# EAGLE design helmholtz_cage_pcb_design (EAGLE 9.5.1)
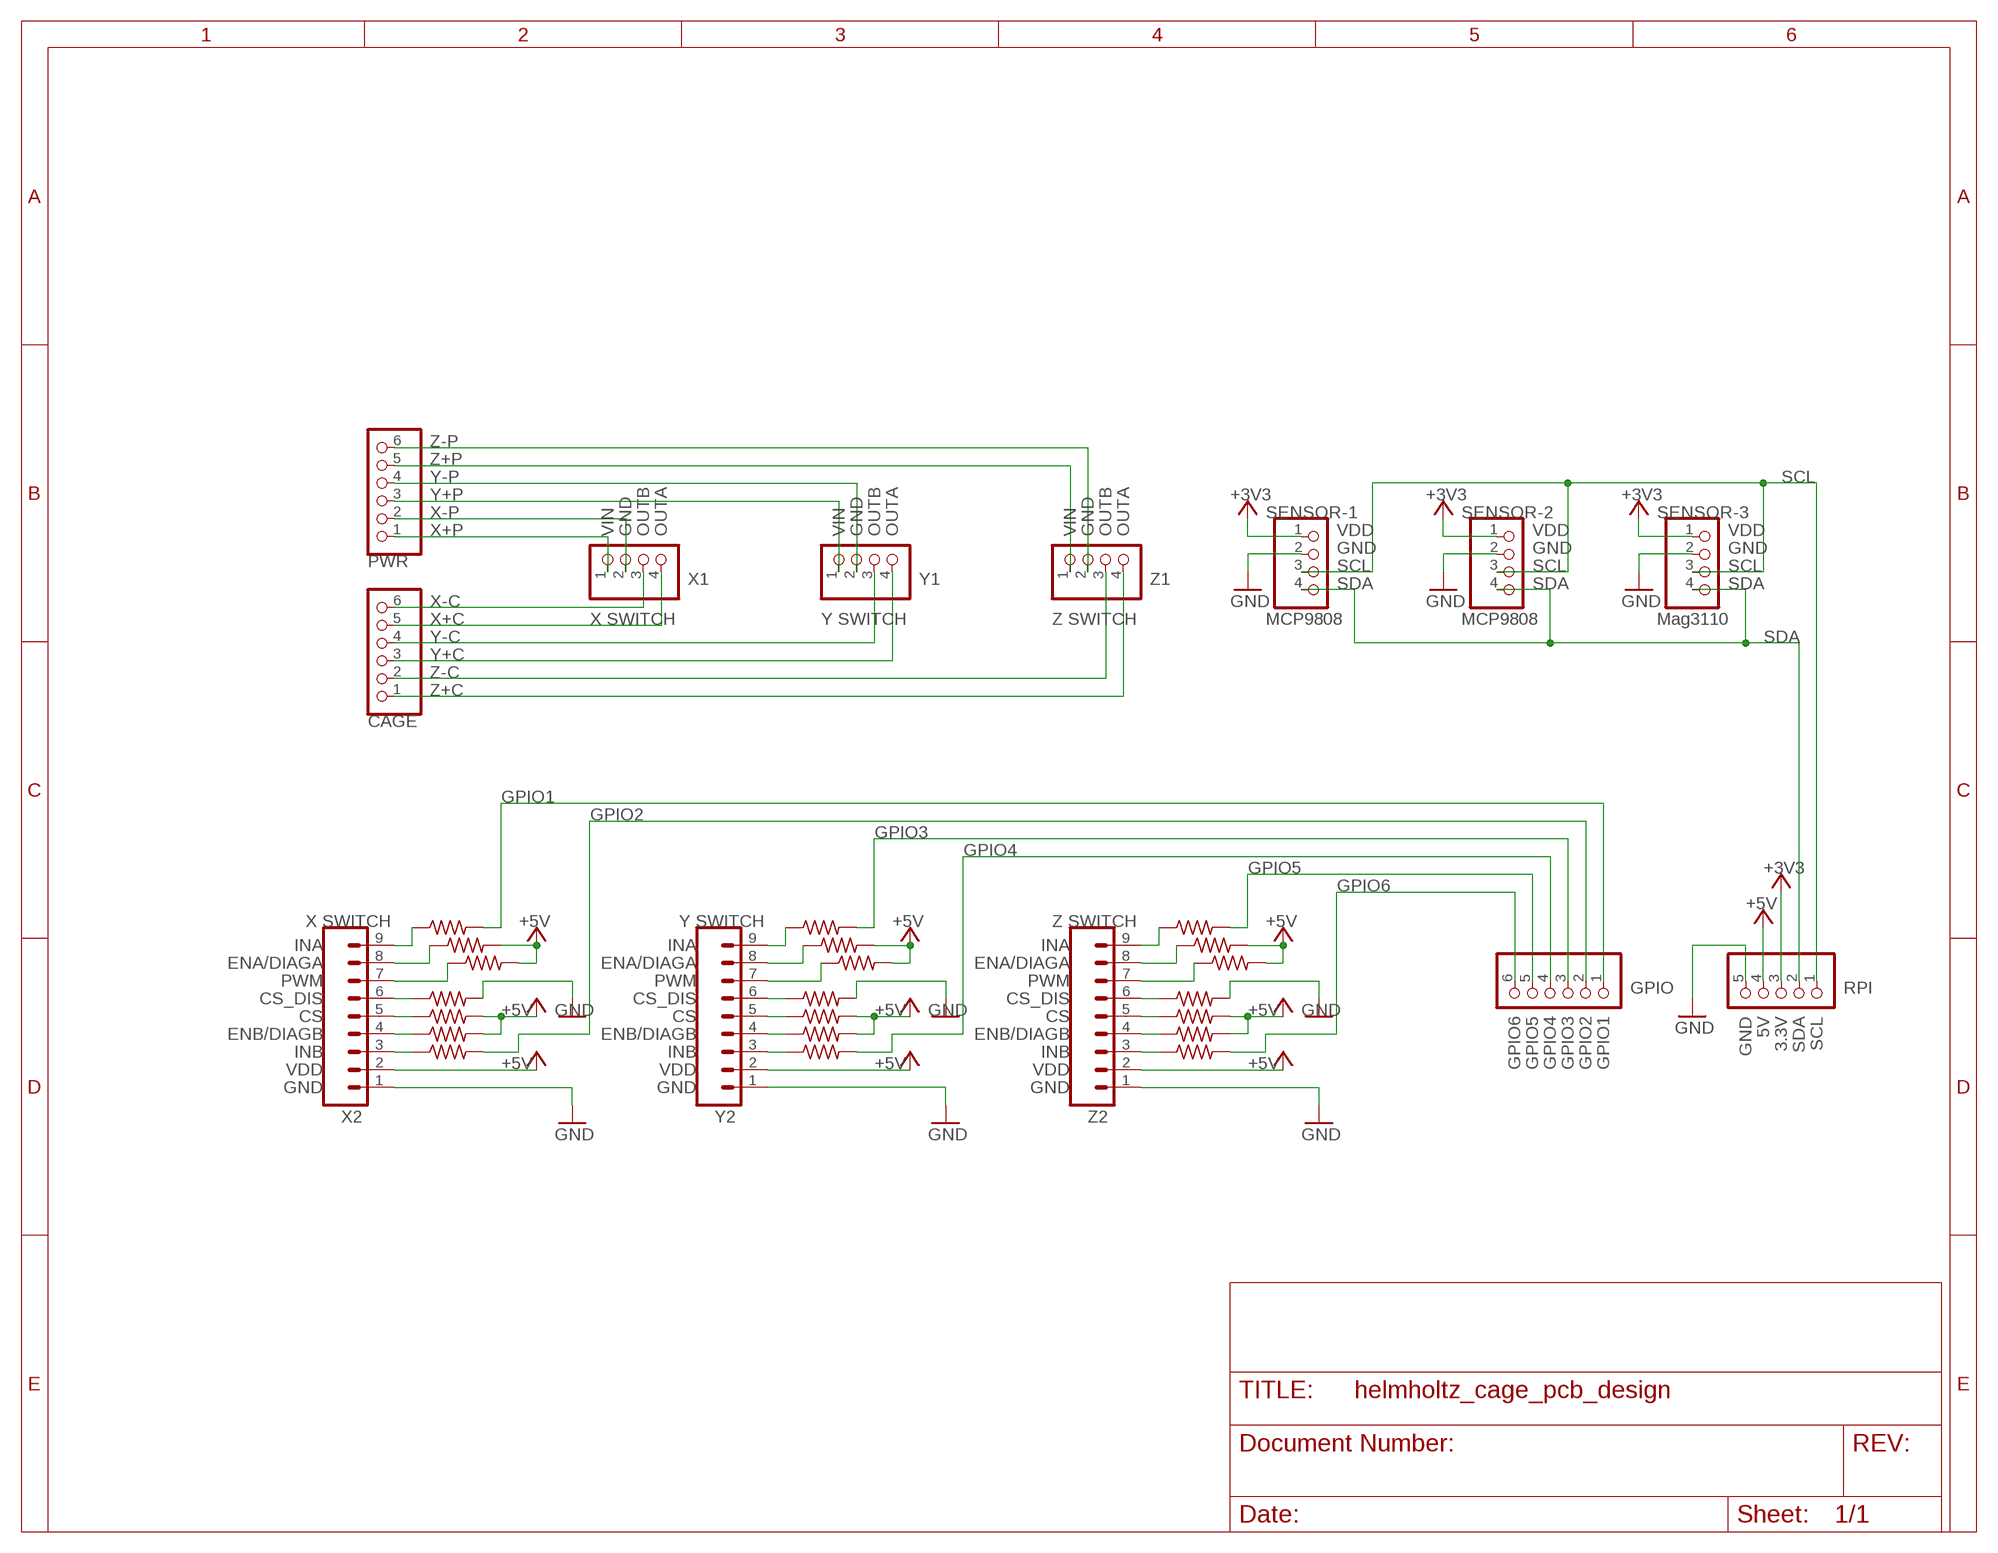
[diagram p0: schematic, sheet 1]

## Parts
CAGE  PINHD-1X6  [1X06]
GPIO  PINHD-1X6  [1X06]
PWR  PINHD-1X6  [1X06]
R1  R-US_0204/7  [0204/7]
R2  R-US_0204/7  [0204/7]
R3  R-US_0204/7  [0204/7]
R4  R-US_0204/7  [0204/7]
R5  R-US_0204/7  [0204/7]
R6  R-US_0204/7  [0204/7]
R7  R-US_0204/7  [0204/7]
R8  R-US_0204/7  [0204/7]
R9  R-US_0204/7  [0204/7]
R10  R-US_0204/7  [0204/7]
R11  R-US_0204/7  [0204/7]
R12  R-US_0204/7  [0204/7]
R13  R-US_0204/7  [0204/7]
R14  R-US_0204/7  [0204/7]
R15  R-US_0204/7  [0204/7]
R16  R-US_0204/7  [0204/7]
R17  R-US_0204/7  [0204/7]
R18  R-US_0204/7  [0204/7]
R19  R-US_0204/7  [0204/7]
R20  R-US_0204/7  [0204/7]
R21  R-US_0204/7  [0204/7]
RPI  PINHD-1X5  [1X05]
SENSOR-1  PINHD-1X4  [1X04]
SENSOR-2  PINHD-1X4  [1X04]
SENSOR-3  PINHD-1X4  [1X04]
X1  PINHD-1X4  [1X04]
X2  CONN_09  [1X09]
Y1  PINHD-1X4  [1X04]
Y2  CONN_09  [1X09]
Z1  PINHD-1X4  [1X04]
Z2  CONN_09  [1X09]

## Nets
+3V3: RPI.3 SENSOR-1.1 SENSOR-2.1 SENSOR-3.1
+5V: R3.2 R4.2 R5.2 R7.2 R8.2 R10.2 R11.2 R12.2 R17.2 R18.2 R19.2 R21.2 RPI.4 X2.2 Y2.2 Z2.2
CSX: R7.1 X2.5
CSY: R8.1 Y2.5
CSZ: R21.1 Z2.5
DISX: R6.1 X2.6
DISY: R9.1 Y2.6
DISZ: R20.1 Z2.6
ENAX: R3.1 X2.8
ENAY: R12.1 Y2.8
ENAZ: R17.1 Z2.8
ENBX: R4.1 X2.4
ENBY: R11.1 Y2.4
ENBZ: R18.1 Z2.4
GND: R6.2 R9.2 R20.2 RPI.5 SENSOR-1.2 SENSOR-2.2 SENSOR-3.2 X2.1 Y2.1 Z2.1
GPIO1: GPIO.1 R1.2
GPIO2: GPIO.2 R2.2
GPIO3: GPIO.3 R14.2
GPIO4: GPIO.4 R13.2
GPIO5: GPIO.5 R15.2
GPIO6: GPIO.6 R16.2
PWMX: R5.1 X2.7
PWMY: R10.1 Y2.7
PWMZ: R19.1 Z2.7
RGP1: R1.1 X2.9
RGP2: R2.1 X2.3
RGP3: R14.1 Y2.9
RGP4: R13.1 Y2.3
RGP5: R15.1 Z2.9
RGP6: R16.1 Z2.3
SCL: RPI.1 SENSOR-1.3 SENSOR-2.3 SENSOR-3.3
SDA: RPI.2 SENSOR-1.4 SENSOR-2.4 SENSOR-3.4
X+C: CAGE.5 X1.4
X+P: PWR.1 X1.1
X-C: CAGE.6 X1.3
X-P: PWR.2 X1.2
Y+C: CAGE.3 Y1.4
Y+P: PWR.3 Y1.1
Y-C: CAGE.4 Y1.3
Y-P: PWR.4 Y1.2
Z+C: CAGE.1 Z1.4
Z+P: PWR.5 Z1.1
Z-C: CAGE.2 Z1.3
Z-P: PWR.6 Z1.2

## Notes on the sheet
- SCL
- VIN | GND | OUTB | OUTA | VIN | GND | OUTB | OUTA | VIN | GND | OUTB | OUTA | VDD | VDD | VDD
- GND | GND | GND
- SCL | SCL | SCL
- SDA | SDA | SDA
- X SWITCH | Y SWITCH | Z SWITCH | MCP9808 | MCP9808 | Mag3110
- SDA
- X SWITCH | Y SWITCH | Z SWITCH
- INA | INA | INA
- ENA/DIAGA | ENA/DIAGA | ENA/DIAGA
- PWM | PWM | PWM
- CS_DIS | CS_DIS | CS_DIS
- CS | CS | CS | GPIO6 | GPIO5 | GPIO4 | GPIO3 | GPIO2 | GPIO1 | GND | 5V | 3.3V | SDA | SCL
- ENB/DIAGB | ENB/DIAGB | ENB/DIAGB
- INB | INB | INB
- VDD | VDD | VDD
- GND | GND | GND

## Library data of the parts
CAGE GPIO PWR = pinhead:PINHD-1X6: PIN HEADER
R1-R21 = rcl:R-US_: RESISTOR, American symbol; SPICEPREFIX: R
RPI = pinhead:PINHD-1X5: PIN HEADER
SENSOR-1-SENSOR-3 X1 Y1 Z1 = pinhead:PINHD-1X4: PIN HEADER
X2 Y2 Z2 = SparkFun-Connectors:CONN_09: Multi connection point. Often used as Generic Header-pin footprint for 0.1 inch spaced/style header connections On any of the 0.1 inch spaced packages, you can populate with these: Break Away Headers - Straight <https://www.sparkfun.com/products/116> (PRT-00116) Break Away Male Headers - Right Angle <https://www.sparkfun.com/products/553> (PRT-00553) Female Headers <https://www.sparkfun.com/products/115> (PRT-00115) Break Away Headers - Machine Pin <https://www.sparkfun.com/products/117> (PRT-00117) Break Away Female Headers - Swiss Machine Pin <https://www.sparkfun.com/products/743> (PRT-00743) For SCREWTERMINALS and SPRING TERMINALS visit here: Screw Terimnals on SparkFun.com <https://www.sparkfun.com/search/results?term=Screw+Terminals> (5mm/3.5mm/2.54mm spacing) This device is also useful as a general connection point to wire up your design to another part of your project. Our various solder wires solder well into these plated through hole pads. Hook-Up Wire - Assortment (Stranded, 22 AWG) <https://www.sparkfun.com/products/11375> (PRT-11375) Hook-Up Wire - Assortment (Solid Core, 22 AWG) <https://www.sparkfun.com/products/11367> (PRT-11367) View the entire wire category on our website here <https://www.sparkfun.com/categories/141> Special notes: Molex polarized connector foot print use with SKU : PRT-08231 with associated crimp pins and housings. 1MM SMD Version SKU: PRT-10208 NOTES ON THE VARIANTS LOCK and LOCK_LONGPADS... This footprint was designed to help hold the alignment of a through-hole component (i.e. 6-pin header) while soldering it into place. You may notice that each hole has been shifted either up or down by 0.005 of an inch from it's more standard position (which is a perfectly straight line). This slight alteration caused the pins (the squares in the middle) to touch the edges of the holes. Because they are alternating, it causes a "brace" to hold the component in place. 0.005 has proven to be the perfect amount of "off-center" position when using our standard breakaway headers. Although looks a little odd when you look at the bare footprint, once you have a header in there, the alteration is very hard to notice. Also,if you push a header all the way into place, it is covered up entirely on the bottom side.

## Board
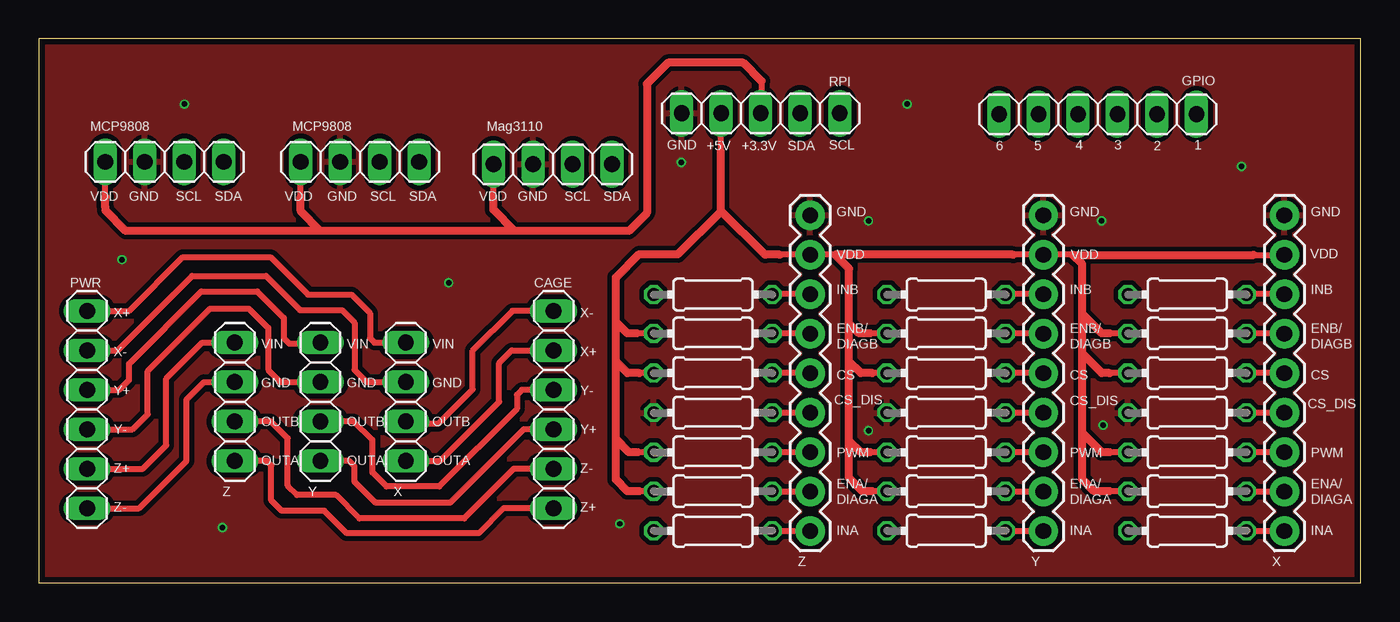
[diagram p1: board, top side]
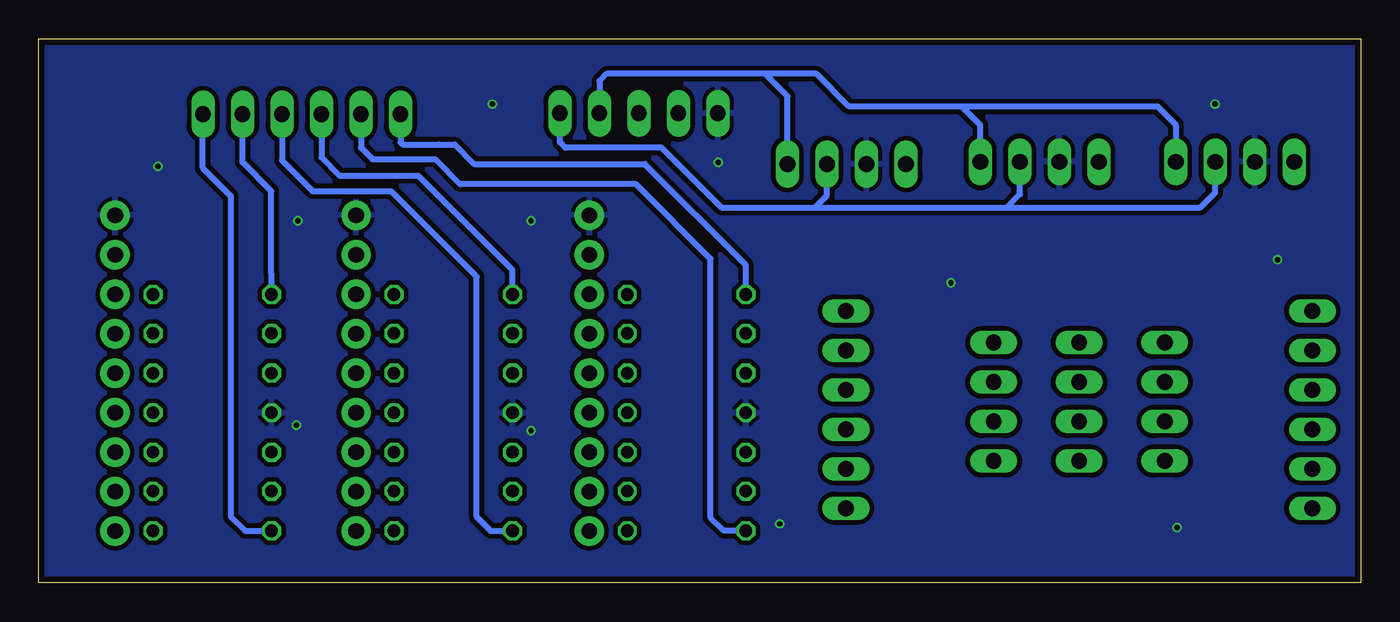
[diagram p2: board, bottom side, seen from below]

Size 85 x 35 mm. Coordinates in mm from the lower left corner, seen from the top.
Outline: 0,0 85,0 85,35 0,35 0,0
Copper layers (1*16): Top 0.035559375mm / dielectric 1.6mm / Bottom 0.035559375mm
Design rules "oshpark-2layer": minimum track width 6mil, minimum drill 10mil, track to track 6mil, track to pad 6mil, pad to pad 6mil, via to via 6mil, smd to smd 6mil, copper to edge 15mil, drill to drill 6mil, minimum pad ring 5mil, minimum via ring 5mil, stop-mask expansion 2.5mil, vias tented up to drill 0mil, thermal gap 10mil

### Footprints (pad centres in the part's own frame; a part is rotated, then mirrored left to right if it is on the bottom)
1X06 = drill 1.016 long: 1 -6.35,0; 2 -3.81,0; 3 -1.27,0; 4 1.27,0; 5 3.81,0; 6 6.35,0
0204/7 = drill 0.813 octagon: 1 -3.81,0; 2 3.81,0
1X05 = drill 1.016 long: 1 -5.08,0; 2 -2.54,0; 3 0,0; 4 2.54,0; 5 5.08,0
1X04 = drill 1.016 long: 1 -3.81,0; 2 -1.27,0; 3 1.27,0; 4 3.81,0
1X09 = drill 1.016 pad 1.88: 1 0,0; 2 2.54,0; 3 5.08,0; 4 7.62,0; 5 10.16,0; 6 12.7,0; 7 15.24,0; 8 17.78,0; 9 20.32,0

### Placement (x,y rotation side)
CAGE  33.1,11.15 90 top
GPIO  68.1,30.15 180 top
PWR  3.1,11.15 270 top
R1  73.85,3.35 180 top
R2  73.85,18.55 180 top
R3  73.85,5.9 180 top
R4  73.85,16.05 180 top
R5  73.85,8.4 180 top
R6  73.85,10.95 180 top
R7  73.85,13.5 180 top
R8  58.35,13.5 180 top
R9  58.35,10.95 180 top
R10  58.35,8.4 180 top
R11  58.35,16.05 180 top
R12  58.35,5.9 180 top
R13  58.35,18.55 180 top
R14  58.35,3.35 180 top
R15  43.35,3.35 180 top
R16  43.35,18.55 180 top
R17  43.35,5.9 180 top
R18  43.35,16.05 180 top
R19  43.35,8.4 180 top
R20  43.35,10.95 180 top
R21  43.35,13.5 180 top
RPI  46.42,30.21 180 top
SENSOR-1  8.08,27.09 0 top
SENSOR-2  20.65,27.09 0 top
SENSOR-3  33.05,26.94 0 top
X1  23.6,11.65 270 top
X2  80.1,23.65 270 top
Y1  18.1,11.65 270 top
Y2  64.6,23.65 270 top
Z1  12.6,11.65 270 top
Z2  49.6,23.65 270 top

### Tracks (layer width: path | path; a pad name or v marks a point on that pad's centre or on a via)
+3V3
  Top 0.4: 4.27,23.98 4.27,24.15 | 4.27,24.85 SENSOR-1.1 | 29.24,24.85 SENSOR-3.1 | 16.84,24.85 SENSOR-2.1 | 46.47,32.28 46.47,30.26 RPI.3
  Top 0.5: 46.47,32.28 45.3,33.45 40.45,33.45 39.1,32.1 39.1,23.8 37.95,22.65 30.6,22.65 | 30.6,22.65 18.1,22.65 | 18.1,22.65 5.6,22.65 4.27,23.98 | 30.6,22.65 29.24,24.01 29.24,24.85 | 18.1,22.65 16.84,23.91 16.84,24.85 | 4.27,24.15 4.27,24.85
+5V
  Top 0.4: R3.2 68.85,5.9 | R7.2 68.85,13.5 | R4.2 68.85,16.05 | R12.2 53.6,5.9 | R10.2 53.45,8.4 | R11.2 53.45,16.05 | R17.2 38.6,5.9 | R18.2 38.45,16.05 | 47.64,21.11 Z2.2 51.2,21.11 | 62.64,21.11 Y2.2 66.49,21.11 66.5,21.1 | R5.2 68.85,8.4 | 43.85,27.75 43.85,30.18 RPI.4 | R19.2 38.5,8.4 | R8.2 53.6,13.5 | R21.2 38.6,13.5 | X2.2 78.13,21.1
  Top 0.5: 38.6,5.9 37.85,5.9 37.1,6.65 37.1,9.25 | 37.1,14.25 37.1,16.8 | 37.1,16.8 37.1,19.65 38.6,21.15 41.1,21.15 43.85,23.9 | 38.6,13.5 37.85,13.5 37.1,14.25 | 38.45,16.05 37.85,16.05 37.1,16.8 | 53.6,5.9 52.95,5.9 52.1,6.75 52.1,9.15 | 52.1,9.15 52.1,14.25 | 52.1,14.25 52.1,16.7 | 53.6,13.5 52.85,13.5 52.1,14.25 | 53.45,16.05 52.75,16.05 52.1,16.7 | 68.85,5.9 67.85,5.9 67.1,6.65 67.1,9.65 | 67.1,9.65 67.1,14.75 | 67.1,14.75 67.1,17.3 | 68.85,8.4 68.35,8.4 67.1,9.65 | 68.85,13.5 68.35,13.5 67.1,14.75 | 68.85,16.05 68.35,16.05 67.1,17.3 | 62.64,21.11 51.2,21.11 52.1,20.21 52.1,16.7 | 67.1,17.3 67.1,20.5 66.5,21.1 78.13,21.1 | 47.64,21.11 46.7,21.11 43.88,23.93 43.85,23.9 | 43.85,23.9 43.85,27.75 | 53.45,8.4 52.85,8.4 52.1,9.15 | 38.5,8.4 37.95,8.4 37.1,9.25 | 37.1,9.25 37.1,14.25
CSX
  Top 0.4: X2.5 R7.1
CSY
  Top 0.4: Y2.5 R8.1
CSZ
  Top 0.4: Z2.5 R21.1
DISX
  Top 0.4: X2.6 R6.1
DISY
  Top 0.4: Y2.6 R9.1
DISZ
  Top 0.4: Z2.6 R20.1
ENAX
  Top 0.4: X2.8 77.69,5.87 R3.1
ENAY
  Top 0.4: Y2.8 62.19,5.87 R12.1
ENAZ
  Top 0.4: Z2.8 47.19,5.87 R17.1
ENBX
  Top 0.4: X2.4 77.68,16.03 R4.1
ENBY
  Top 0.4: Y2.4 62.18,16.03 R11.1
ENBZ
  Top 0.4: Z2.4 47.18,16.03 R18.1
GND  (via drill 0.35)
  other vias: 53.35,9.8 68.45,10.15 37.35,3.8 26.35,19.3 9.35,30.8 5.35,20.8 77.35,26.8 55.85,30.8 53.35,23.3 11.8,3.55 68.35,23.3 41.3,27.05
  pour Top (isolate 0.3): 0,35 85,35 85,0 0,0
  pour Bottom (isolate 0.3): 0,30 0,35 85,35 85,0 0,0
GPIO1
  Bottom 0.4: GPIO.1 74.45,26.7 72.65,24.9 72.65,4.25 71.75,3.35 R1.2
GPIO2
  Bottom 0.4: R2.2 70.04,19.89 70.05,19.9 70.05,25.2 71.91,27.06 GPIO.2
GPIO3
  Bottom 0.4: R14.2 55.94,3.34 56.85,4.25 56.85,19.7 62.35,25.2 67.4,25.2 69.37,27.17 GPIO.3
GPIO4
  Bottom 0.4: R13.2 54.54,20.14 60.6,26.2 65.65,26.2 66.83,27.38 GPIO.4
GPIO5
  Bottom 0.4: R15.2 40.95,3.35 41.8,4.2 41.8,20.85 46.6,25.65 57.9,25.65 59.5,27.25 63.55,27.25 64.29,27.99 GPIO.5
GPIO6
  Bottom 0.4: R16.2 39.54,20.44 46.05,26.95 57,26.95 58.25,28.2 59.27,28.2 61.6,28.2 61.75,28.35 GPIO.6
PWMX
  Top 0.4: X2.7 R5.1
PWMY
  Top 0.4: Y2.7 R10.1
PWMZ
  Top 0.4: Z2.7 R19.1
RGP1
  Top 0.4: X2.9 77.68,3.33 R1.1
RGP2
  Top 0.4: X2.3 77.68,18.57 R2.1
RGP3
  Top 0.4: Y2.9 62.18,3.33 R14.1
RGP4
  Top 0.4: Y2.3 62.18,18.57 R13.1
RGP5
  Top 0.4: Z2.9 47.18,3.33 R15.1
RGP6
  Top 0.4: Z2.3 47.18,18.57 R16.1
SCL
  Bottom 0.4: 35.1,24.15 41.1,24.15 44.95,28 51.15,28 51.5,28.35 RPI.1 | SENSOR-3.3 34.32,24.93 35.1,24.15 | 35.1,24.15 22.75,24.15 | 22.75,24.15 21.9,25 21.9,27.07 SENSOR-2.3 | 22.75,24.15 10.3,24.15 9.35,25.1 SENSOR-1.3
SDA
  Bottom 0.4: SENSOR-1.4 11.89,29.49 13.05,30.65 25.65,30.65 | SENSOR-2.4 24.46,29.46 25.65,30.65 | RPI.2 48.96,32.29 48.5,32.75 38.3,32.75 | SENSOR-3.4 36.85,31.3 38.3,32.75 | 38.3,32.75 35,32.75 32.9,30.65 25.65,30.65
X+C
  Top 0.4: X1.4 25.79,7.84 29.6,11.65 29.6,14.15 30.41,14.96 CAGE.5
X+P
  Top 0.4: PWR.1 5.8,17.5 9.25,20.95 14.9,20.95 17.3,18.55 20.1,18.55 21.3,17.35 21.3,15.75 21.59,15.46 X1.1
X-C
  Top 0.4: CAGE.6 30.45,17.5 27.9,14.95 27.9,12.45 25.68,10.23 23.75,10.23 X1.3
X-P
  Top 0.4: PWR.2 5.06,14.96 9.85,19.75 14.6,19.75 16.8,17.55 19.5,17.55 20.3,16.75 20.3,13.7 21.08,12.92 X1.2
Y+C
  Top 0.4: CAGE.3 31.18,9.88 26.45,5.15 21.65,5.15 20.3,6.5 20.3,7.5 19.95,7.85 Y1.4
Y+P
  Top 0.4: PWR.3 5.17,12.42 5.8,13.05 5.8,14.1 10.45,18.75 14.05,18.75 15.75,17.05 15.75,15.75 16.1,15.4 18.04,15.4 Y1.1
Y-C
  Top 0.4: CAGE.4 31.07,12.42 30.75,12.1 30.75,11.2 25.75,6.2 22.35,6.2 21.45,7.1 21.45,9.2 20.25,10.4 18.12,10.4 Y1.3
Y-P
  Top 0.4: PWR.4 6.03,9.88 7,10.85 7,13.65 11,17.65 13.5,17.65 14.75,16.4 14.75,13.7 15.53,12.92 Y1.2
Z+C
  Top 0.4: CAGE.1 29.9,4.8 28.3,3.2 19.8,3.2 18.35,4.65 15.6,4.65 14.95,5.3 14.95,7.55 14.65,7.85 Z1.4
Z+P
  Top 0.4: PWR.5 6.69,7.34 8.2,8.85 8.2,13.15 10.51,15.46 Z1.1
Z-C
  Top 0.4: CAGE.2 30.54,7.34 27.35,4.15 20.6,4.15 19.1,5.65 16.6,5.65 16,6.25 16,9.3 14.9,10.4 12.62,10.4 Z1.3
Z-P
  Top 0.4: PWR.6 6.45,4.8 9.5,7.85 9.5,11.8 10.62,12.92 Z1.2

### Text on the board
tNames: MCP9808 | MCP9808 | Mag3110 | GND | +5V | +3.3V | SDA | SCL | 6 | 5 | 4 | 3 | 2 | 1 | VDD | GND | SCL | SDA | VDD | GND | SCL | SDA | VDD | GND | SCL | SDA | GND | GND | GND | VDD | VDD | VDD | INB | INB | INB | X+ | X- | ENB/ | ENB/ | ENB/ | X- | VIN | VIN | VIN | X+ | DIAGB | DIAGB | DIAGB | GND | GND | GND | CS | CS | CS | Y+ | Y- | CS_DIS | CS_DIS | CS_DIS | Y- | OUTB | OUTB | OUTB | Y+ | OUTA | OUTA | OUTA | PWM | PWM | PWM | Z+ | Z- | Z | Y | X | ENA/ | ENA/ | ENA/ | Z- | Z+ | DIAGA | DIAGA | DIAGA | INA | INA | INA | Z | Y | X